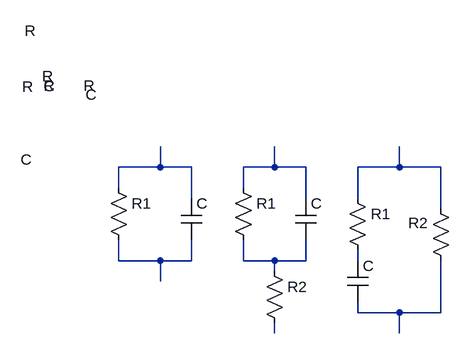
[diagram p0: schematic modelagem_software_phatons_elétricos.asc]
modelagem_software_phatons_elétricos.asc, the LTspice schematic file:
Version 4
SHEET 1 880 680
WIRE 16 64 16 32
WIRE 16 64 -48 64
WIRE 64 64 16 64
WIRE 192 64 192 32
WIRE 192 64 144 64
WIRE 240 64 192 64
WIRE 384 64 384 32
WIRE 384 64 320 64
WIRE 448 64 384 64
WIRE -48 96 -48 64
WIRE 144 96 144 64
WIRE 64 112 64 64
WIRE 240 112 240 64
WIRE 320 112 320 64
WIRE 448 128 448 64
WIRE -48 208 -48 176
WIRE 16 208 -48 208
WIRE 64 208 64 176
WIRE 64 208 16 208
WIRE 144 208 144 176
WIRE 192 208 144 208
WIRE 240 208 240 176
WIRE 240 208 192 208
WIRE 320 208 320 192
WIRE 192 224 192 208
WIRE 16 240 16 208
WIRE 320 288 320 272
WIRE 384 288 320 288
WIRE 448 288 448 208
WIRE 448 288 384 288
WIRE 192 320 192 304
WIRE 384 320 384 288
SYMBOL res -64 80 R0
WINDOW 3 -38 -142 Left 2
SYMATTR InstName R1
SYMBOL cap 48 112 R0
WINDOW 3 -147 -160 Left 2
SYMATTR InstName C
SYMBOL res 176 208 R0
WINDOW 3 -340 -270 Left 2
SYMATTR InstName R2
SYMBOL res 128 80 R0
WINDOW 3 -294 -156 Left 2
SYMATTR InstName R1
SYMBOL cap 224 112 R0
WINDOW 3 -388 -173 Left 2
SYMATTR InstName C
SYMBOL cap 304 208 R0
WINDOW 3 -503 -156 Left 2
SYMATTR InstName C
SYMBOL res 304 96 R0
WINDOW 3 -497 -242 Left 2
SYMATTR InstName R1
SYMBOL res 432 112 R0
WINDOW 0 -34 38 Left 2
WINDOW 3 -629 -172 Left 2
SYMATTR InstName R2

The netlist it stands for:
* modelagem_software_phatons_elétricos.asc
R1 N001 N004 R
C N001 N004 C
R2 N005 N008 R
R1 N002 N005 R
C N002 N005 C
C N006 N007 C
R1 N003 N006 R
R2 N003 N007 R
.backanno
.end